# Altium schematic sheet Sheet2.SchDoc
size A4; SheetNumber: 2; SheetTotal: 2
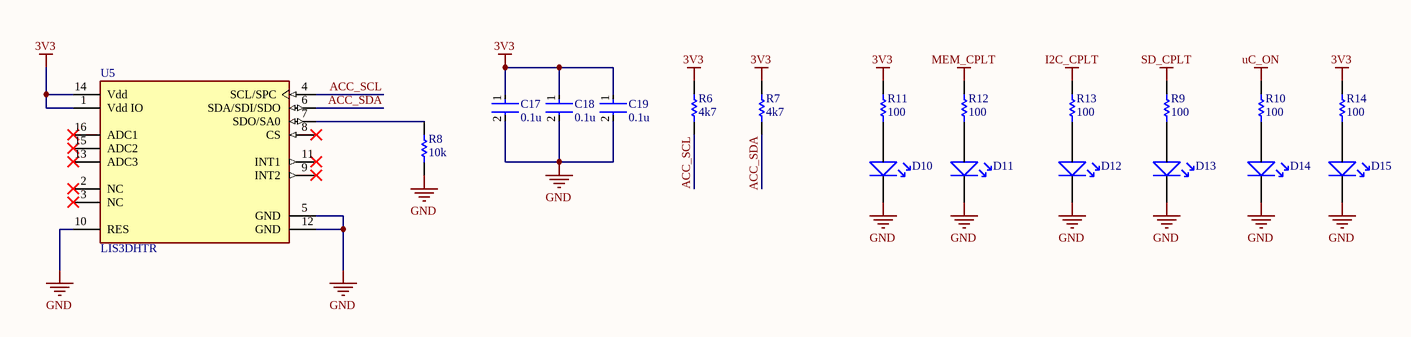
[diagram p0: Sheet2.SchDoc]

## Parts
C17  0.1u  [FP-C0603C-CF-MFG]
C18  0.1u  [FP-C0603C-CF-MFG]
C19  0.1u  [FP-C0603C-CF-MFG]
D10  0603 LED  [0603 LED]  (value not drawn)
D11  0603 LED  [0603 LED]  (value not drawn)
D12  0603 LED  [0603 LED]  (value not drawn)
D13  0603 LED  [0603 LED]  (value not drawn)
D14  0603 LED  [0603 LED]  (value not drawn)
D15  0603 LED  [0603 LED]  (value not drawn)
R6  4k7  [RESC1609X50X30NL8T20]
R7  4k7  [RESC1609X50X30NL8T20]
R8  10k  [RESC1609X50X30NL8T20]
R9  100  [RESC1609X50X30NL8T20]
R10  100  [RESC1609X50X30NL8T20]
R11  100  [RESC1609X50X30NL8T20]
R12  100  [RESC1609X50X30NL8T20]
R13  100  [RESC1609X50X30NL8T20]
R14  100  [RESC1609X50X30NL8T20]
U5  LIS3DHTR  [FP-LGA-16-7983231-MFG]

## Nets
3V3: C17.1 C18.1 C19.1 R6.2 R7.2 R11.2 R14.2 U5.1(Vdd_IO) U5.14(Vdd)
GND: C17.2 C18.2 C19.2 D10.2 D11.2 D12.2 D13.2 D14.2 D15.2 R8.1 U5.5(GND) U5.10(RES) U5.12(GND)
I2C_CPLT: R13.2
MEM_CPLT: R12.2
SD_CPLT: R9.2
uC_ON: R10.2
ACC_SCL: R6.1 U5.4(SCL/SPC)
ACC_SDA: R7.1 U5.6(SDA/SDI/SDO)
NetD10_1: D10.1 R11.1
NetD11_1: D11.1 R12.1
NetD12_1: D12.1 R13.1
NetD13_1: D13.1 R9.1
NetD14_1: D14.1 R10.1
NetD15_1: D15.1 R14.1
NetR8_2: R8.2 U5.7(SDO/SA0)

Not connected (* = marked no-connect by the designer): U5 2(NC)* 3(NC)* 8(CS)* 9(INT2)* 11(INT1)* 13(ADC3)* 15(ADC2)* 16(ADC1)*

## Library data of the parts
C17-C19 = CMP-2006-03061-2: CAP CER 0.1UF 50V X7R 0603; Manufacturer: KEMET; Manufacturer Part Number: C0603C104K5RACTU; Tolerance: 0.1; Temperature Coefficient: 30ppm/°C; Material: Ceramic; Automotive Grade: Grade 1; Value: 0.10 μF; Temperature: -55°C to +125°C; RoHS: TRUE; Temperature Range High: +125°C; Lead Free: Yes; Octopart: https://octopart.com/c0603c104k5ractu-kemet-139244; Digikey Description: CAP CER 0.1UF 50V X7R 0603; Category: Cap; Package: C0603C-CF; ComponentLink2Description: Datasheet; Temperature Range Low: -55°C; Device Class L1: Passive Components; Voltage Rating: 50 V; Automotive: Yes; Device Class L3: Ceramic Capacitors; ComponentLink2URL: https://api.kemet.com/component-edge/download/datasheet/C0603C100J5GACAUTO.pdf; Capacitance: 0.10 μF; Device Class L2: Capacitors; Temperature Characteristic: X7R; Height: 0.87mm
R6-R14 = CMP-1666-00005-4: Chip Resistor, 10 KOhm, +/- 1%, 100 mW, -55 to 155 degC, 0603 (1608 Metric), RoHS, Tape and Reel; Manufacturer: Vishay Semiconductor; Voltage Rating: 75 V; Max Operating Temperature: 155 degC; PackageDescription: 2-Pin Surface Mount Device, Body 1.575 x 0.85 mm; ComponentLink1Description: Manufacturer URL; RoHSCompliant: true; PackageReference: 0603; REACH SVHC: Unknown; Length: 1.55 mm; DatasheetVersion: 06/2012; Packaging: Tape and Reel; Min Operating Temperature: -55 degC; Mounting Technology: Surface Mount; ComponentLink2URL: https://datasheet.ciiva.com/11809/0900766b80d98afc-11809037.pdf; Height: 0.45 mm; ComponentLink2Description: Datasheet; Package Quantity: 5000; ComponentLink1URL: http://www.vishay.com/
U5 = CMP-0234-00055-6: ACCEL 2-16G I2C/SPI 16LGA; Max Supply Voltage: 3.6V; Bandwidth: 5kHz; Min Supply Voltage (DC): 1.71V; Interface: I2C; Axis: X, Y, Z; Operating Supply Voltage: 2.5V; Operating Supply Current: 11uA; Output Type: Digital; Resolution: 16b; Sensor Type: 3 Axis; Series: -; Package Quantity: 1; Case/Package: LGA; Radiation Hardening: No; Min Operating Temperature: -40°C; Length: 3mm; Max Supply Voltage (DC): 3.6V; Lead Free: Lead Free; Height: 1mm; Number of Pins: 16; RoHS Compliant: Yes; Packaging: Tape and Reel; Width: 3mm; Contact Plating: Gold; Max Operating Temperature: 85°C; Min Supply Voltage: 1.71V; REACH SVHC: No SVHC; Depth: 3mm